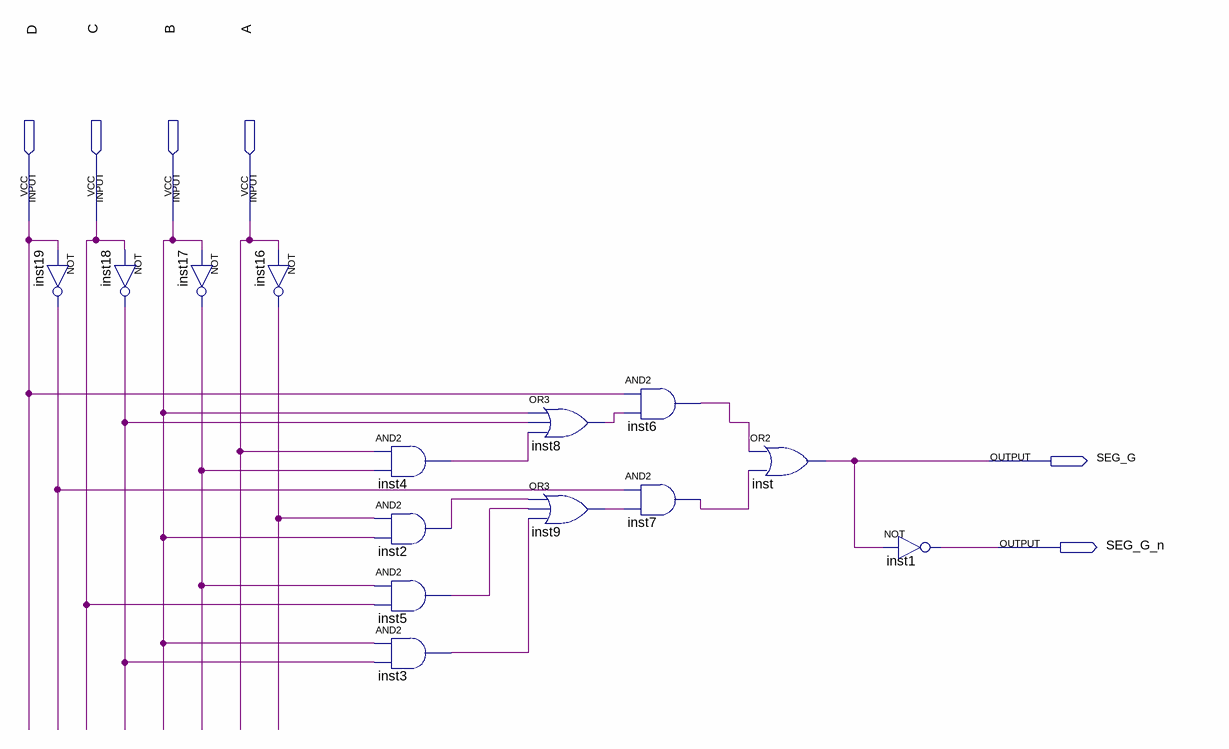
[diagram p0: schematic sheet]
// Quartus schematic SEG_G.bdf as structural Verilog: 14 symbols, 6 pins
module SEG_G (
  input  D,
  input  C,
  input  B,
  input  A,
  output SEG_G,
  output SEG_G_n
);

  wire inst2_out, inst3_out, inst4_out, inst5_out, inst6_out, inst7_out, inst8_out, inst9_out, inst16_out,
       inst17_out, inst18_out, inst19_out;

  not inst19 (inst19_out, D);
  not inst18 (inst18_out, C);
  not inst17 (inst17_out, B);
  not inst16 (inst16_out, A);
  and inst4 (inst4_out, A, inst17_out);
  and inst2 (inst2_out, inst16_out, B);
  and inst5 (inst5_out, inst17_out, C);
  and inst3 (inst3_out, B, inst18_out);
  or inst8 (inst8_out, B, inst18_out, inst4_out);
  or inst9 (inst9_out, inst2_out, inst5_out, inst3_out);
  and inst6 (inst6_out, D, inst8_out);
  and inst7 (inst7_out, inst19_out, inst9_out);
  or inst (SEG_G, inst6_out, inst7_out);
  not inst1 (SEG_G_n, SEG_G);
endmodule
